# Altium schematic sheet CC254x_Board1.SchDoc
size A3
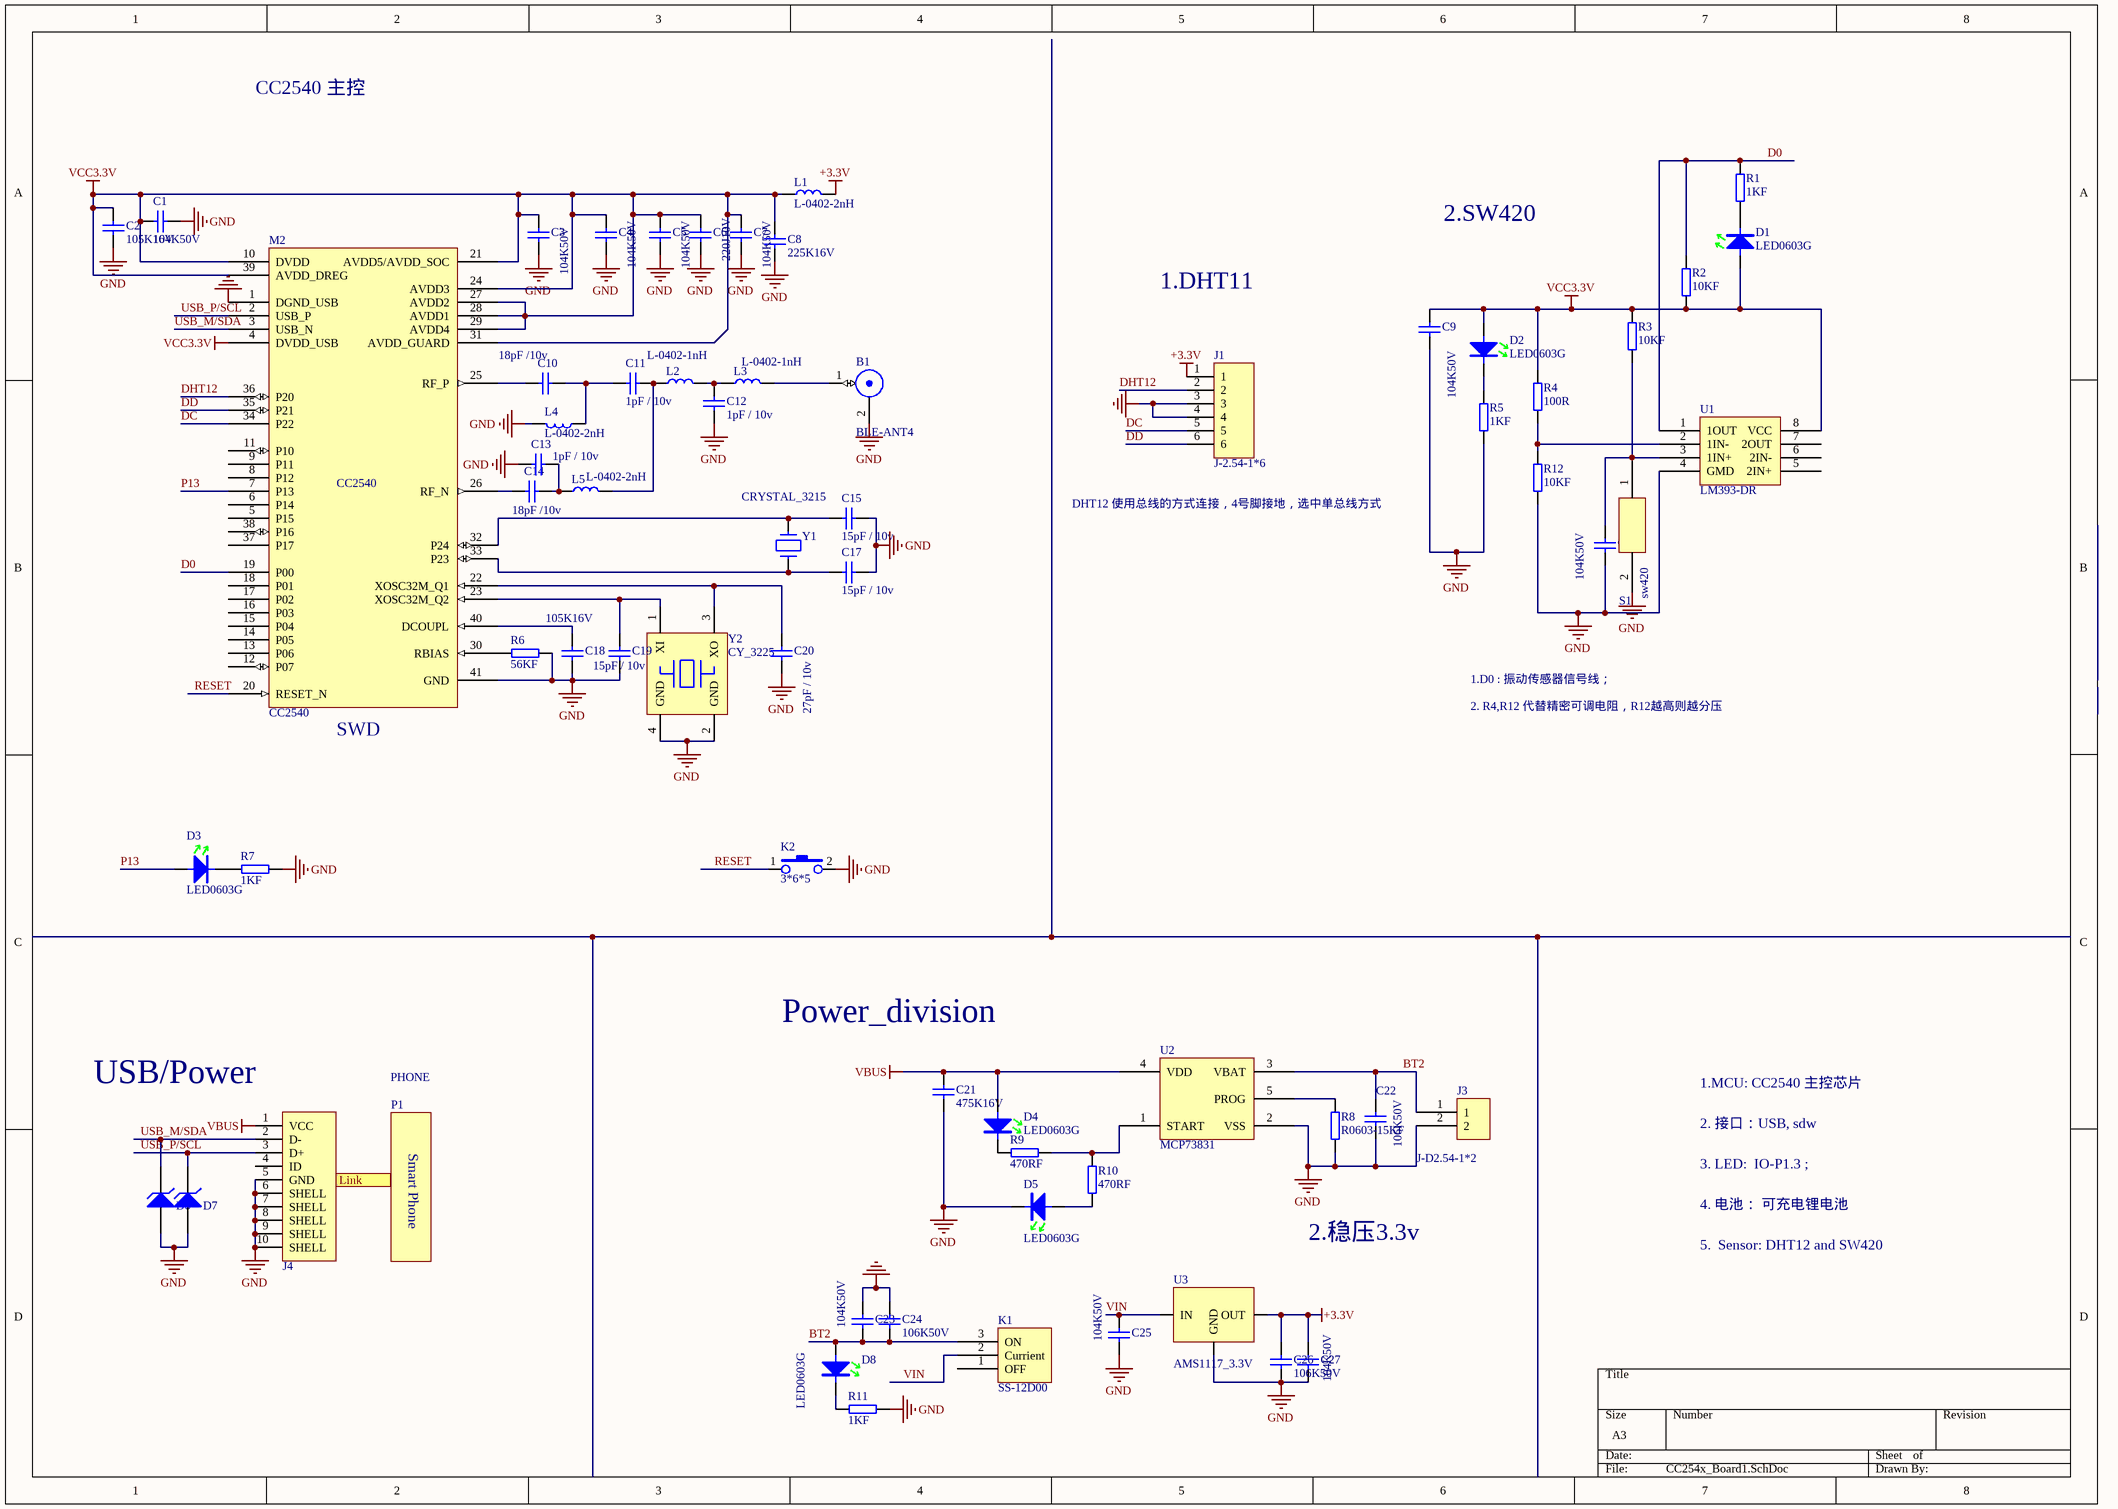
[diagram p0: CC254x_Board1.SchDoc]

## Parts
B1  BLE-ANT4  [BLE-ANTS2]
C1  104K50V  [C0603]
C2  105K16V  [C0603]
C3  104K50V  [C0603]
C4  104K50V  [C0603]
C5  104K50V  [C0603]
C6  220J10V  [C0402]
C7  104K50V  [C0603]
C8  225K16V  [C0603]
C9  104K50V  [C0603]
C10  18pF /10v  [C0402]
C11  1pF / 10v  [C0402]
C12  1pF / 10v  [C0402]
C13  1pF / 10v  [C0402]
C14  18pF /10v  [C0402]
C15  15pF / 10v  [C0402]
C16  104K50V  [C0603]
C17  15pF / 10v  [C0402]
C18  105K16V  [C0603]
C19  15pF / 10v  [C0402]
C20  27pF / 10v  [C0402]
C21  475K16V  [C0603]
C22  106K50V  [C0603]
C23  104K50V  [C0603]
C24  106K50V  [C0603]
C25  104K50V  [C0603]
C26  106K50V  [C0603]
C27  104K50V  [C0603]
D1  LED0603G  [D-LED0603G]
D2  LED0603G  [D-LED0603G]
D3  LED0603G  [D-LED0603G]
D4  LED0603G  [D-LED0603G]
D5  LED0603G  [D-LED0603G]
D6  ESDA_TR1/0603  [HS_0603D]  (value not drawn)
D7  ESDA_TR1/0603  [HS_0603D]  (value not drawn)
D8  LED0603G  [D-LED0603G]
J1  J-2.54-1*6  [D2.54-1*6]
J3  J-D2.54-1*2  [D2.54-1*2P]
J4  USB-MINI-SOCKET  [MICRO-USB - 5.9]  (value not drawn)
K1  SS-12D00  [SS-12D00]
K2  3*6*5  [S-K3*6]
L1  L-0402-2nH  [L0402]
L2  L-0402-1nH  [L0402]
L3  L-0402-1nH  [L0402]
L4  L-0402-2nH  [L0402]
L5  L-0402-2nH  [L0402]
M2  CC2540  [CC254X_QFN]
P1  PHONE
R1  1KF  [R0603]
R2  10KF  [R0603]
R3  10KF  [R0603]
R4  100R  [R0603]
R5  1KF  [R0603]
R6  56KF  [R0603]
R7  1KF  [R0603]
R8  R0603-15KF  [R0603]
R9  470RF  [R0603]
R10  470RF  [R0603]
R11  1KF  [R0603]
R12  10KF  [R0603]
S1  sw420  [sw420]
U1  LM393-DR  [LM393]
U2  MCP73831  [SOT23-5N]
U3  AMS1117_3.3V  [SOT-223]
Y1  CRYSTAL_3215  [CRYSTAL_3215]
Y2  CY_3225  [CY_3225]

## Ports
Link

## Nets
+3.3V: C26.2 C27.1 J1.1 L1.2 U3.2(OUT)
GND: B1.2 C1.2 C2.1 C3.1 C4.1 C5.1 C6.2 C7.1 C8.2 C9.2 C12.2 C13.2 C15.2 C16.2 C17.2 C18.1 C19.2 C20.2 C21.2 C22.2 C23.1 C24.2 C25.2 C26.1 C27.2 D5.2 D6.1(A) D7.1(A) J1.3 J1.4 J3.2 J4.5(GND) J4.6(SHELL) J4.7(SHELL) J4.8(SHELL) J4.9(SHELL) J4.10(SHELL) K2.2 L4.2 M2.1(DGND_USB) M2.41(GND) R5.1 R6.2 R7.2 R8.1 R11.2 R12.1 U1.4(GMD) U2.2(VSS) U3.1(GND) Y2.2(GND) Y2.4(GND)
VBUS: C21.1 D4.1 J4.1(VCC) U2.4(VDD)
VCC3.3V: C1.1 C2.2 C3.2 C4.2 C5.2 C6.1 C7.2 C8.1 C9.1 D1.1 D2.1 L1.1 M2.4(DVDD_USB) M2.10(DVDD) M2.21(AVDD5/AVDD_SOC) M2.24(AVDD3) M2.27(AVDD2) M2.28(AVDD1) M2.29(AVDD4) M2.31(AVDD_GUARD) M2.39(AVDD_DREG) R2.1 R3.2 R4.2 U1.8(VCC)
BT2: C22.1 C23.2 C24.1 D8.1 J3.1 K1.3(ON) U2.3(VBAT)
D0: M2.19(P00) R1.1 R2.2 U1.1(1OUT)
DC: J1.5 M2.34(P22)
DD: J1.6 M2.35(P21)
DHT12: J1.2 M2.36(P20)
P13: D3.1 M2.7(P13)
RESET: K2.1 M2.20(RESET_N)
USB_M/SDA: D6.2(K) J4.2(D-) M2.3(USB_N)
USB_P/SCL: D7.2(K) J4.3(D+) M2.2(USB_P)
VIN: C25.1 K1.2(Currient) U3.3(IN)
NetB1_1: B1.1 L3.2
NetC10_1: C10.1 C11.2 L4.1
NetC10_2: C10.2 M2.25(RF_P)
NetC11_1: C11.1 L2.1 L5.2
NetC12_1: C12.1 L2.2 L3.1
NetC13_1: C13.1 C14.1 L5.1
NetC14_2: C14.2 M2.26(RF_N)
NetC15_1: C15.1 M2.32(P24) Y1.2
NetC16_1: C16.1 R3.1 S1.1 U1.3(1IN+)
NetC17_1: C17.1 M2.33(P23) Y1.1
NetC18_2: C18.2 M2.40(DCOUPL)
NetC19_1: C19.1 M2.23(XOSC32M_Q2) Y2.1(XI)
NetC20_1: C20.1 M2.22(XOSC32M_Q1) Y2.3(XO)
NetD1_2: D1.2 R1.2
NetD2_2: D2.2 R5.2
NetD3_2: D3.2 R7.1
NetD4_2: D4.2 R9.1
NetD5_1: D5.1 R10.1
NetD8_2: D8.2 R11.1
NetM2_30: M2.30(RBIAS) R6.1
NetR4_1: R4.1 R12.2 U1.2(1IN-)
NetR8_2: R8.2 U2.5(PROG)
NetR9_2: R9.2 R10.2 U2.1(START)

Not connected (* = marked no-connect by the designer): J4 4(ID); K1 1(OFF); M2 5(P15) 6(P14) 8(P12) 9(P11) 11(P10) 12(P07) 13(P06) 14(P05) 15(P04) 16(P03) 17(P02) 18(P01) 37(P17) 38(P16); S1 2; U1 5(2IN+) 6(2IN-) 7(2OUT)

## Notes on the sheet
- CC2540 主控
- 2.SW420
- 1.DHT11
- DHT12 使用总线的方式连接，4号脚接地，选中单总线方式
- 1.D0 : 振动传感器信号线；
- 2. R4,R12 代替精密可调电阻，R12越高则越分压
- (near M2) SWD
- Power_division
- (near J4) USB/Power
- 2. 接口：USB, sdw
- 1.MCU: CC2540 主控芯片
- 3. LED:  IO-P1.3 ;
- 2.稳压3.3v
- 4. 电池： 可充电锂电池
- 5.  Sensor: DHT12 and SW420
- Labels drawn without touching a wire or pin: GND
- (in symbol PHONE) Smart Phone

## Library data of the parts
B1 = ANT
C1 C3-C5 C7 C9 C16 C23 C25 C27 = C0603X7R-104K50V: 贴片电容-陶瓷; 规格型号: 100nF±10%_50V_X7R_C0603; 生产商: 风华 三星; 供应商: *; 备注: *
C2 C18 = C0603X7R-105K16V: 贴片电容-陶瓷; 规格型号: 1uF±10%_16V_X7R_C0603; 生产商: 风华 三星; 供应商: *; 备注: *
C6 = C0402X7R-220J10V: 贴片电容-陶瓷; 规格型号: 22pF±5%_10V_X7R_C0402; 生产商: 风华 三星; 供应商: *; 备注: *
C8 = C0603X7R-225K16V: 贴片电容-陶瓷; 规格型号: 2.2uF±10%_16V_X7R_C0603; 生产商: 风华 三星; 供应商: *; 备注: *
C10-C15 C17 C19 C20 = C0402X7R-101J10V: 贴片电容-陶瓷; 规格型号: 100pF±5%_10V_X7R_C0402; 生产商: 风华 三星; 供应商: *; 备注: *
C21 = C0603X7R-475K16V: 贴片电容-陶瓷; 规格型号: 4.7uF±10%_16V_X7R_C0603; 生产商: 风华 三星; 供应商: *; 备注: *
C22 C24 C26 = C0603X7R-106K50V: 贴片电容-陶瓷; 规格型号: 10uF±10%_50V_X7R_C0603; 生产商: 风华 三星; 供应商: *; 备注: *
D1-D5 D8 = DLED-0603-G: 贴片二极管-LED; 规格型号: 0603-GREEN; 货品编码: 无样品无编码; 生产商: *; 供应商: *; 备注: *
D6 D7 = D Zener: Zener Diode; Published: *; LatestRevisionDate: *; LatestRevisionNote: *; PackageReference: *; Publisher: *
J1 = J-2.54-6: 单排
J3 = J-D2.54-1*2单排
J4 = J-USB-MINI-SOCKET: USB-A卧式插座; 供应商: *; 备注: *
K1 = SS-12D00(1P2T) 立式 柄高5MM
K2 = 3*6*5: 贴片-卧式轻触开关
L1 L4 L5 = L-0402-2nH: 贴片电感-层叠
L2 L3 = L-0402-2.2nH: 贴片电感-层叠
R1 R5 R7 R11 = R0603-1KF: 贴片电阻-通用; 生产商: 厚声 国巨; 规格型号: 1K±1%_1/10W_±200ppm_R0603; 货品编码: 无样品无编码; 备注: *; 供应商: *
R2-R4 R12 = R0603-10KF: 贴片电阻-通用; 生产商: 厚声 国巨; 规格型号: 10K±1%_1/10W_±200ppm_R0603; 备注: *; 供应商: *
R6 = R0603-47KF: 贴片电阻-通用; 生产商: 厚声 国巨; 规格型号: 47K±1%_1/10W_±200ppm_R0603; 货品编码: 无样品无编码; 备注: *; 供应商: *
R8 = R0603-15KF: 贴片电容-通用
R9 R10 = R0603-470RF: 贴片电阻-通用; 生产商: 厚声 国巨; 规格型号: 470R±1%_1/10W_±200ppm_R0603; 货品编码: 无样品无编码; 备注: *; 供应商: *
S1 = sw420: 常闭振动传感器
U1 = LM393-DR: 双路比较器
U2 = MCP73831: charge IC
U3 = AMS1117-3.3V
Y1 = CRYSTAL_3215: CRYSTAL_3215，两脚